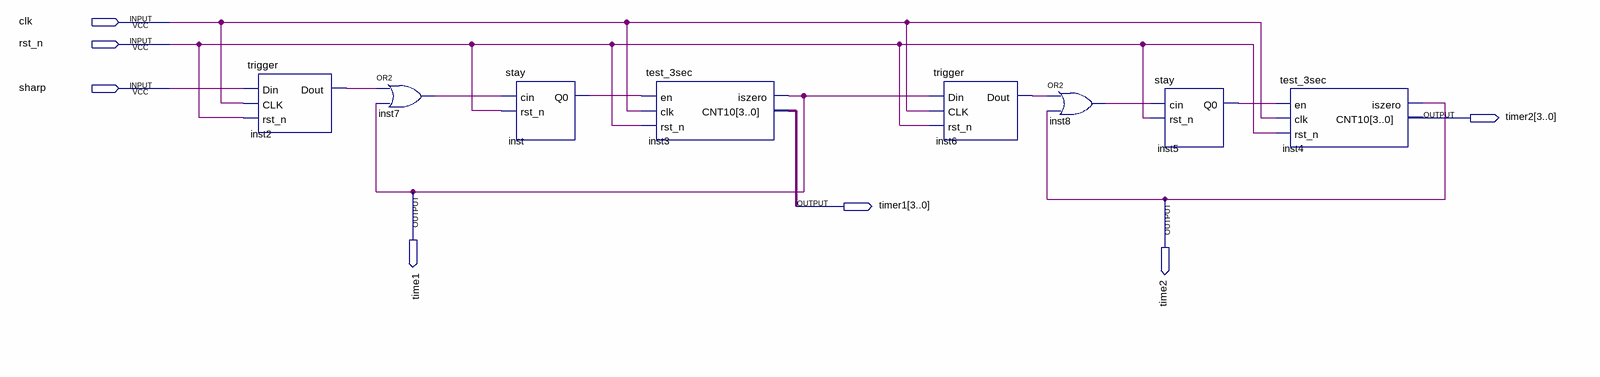
[diagram p0: schematic sheet]
// Quartus schematic test.bdf as structural Verilog: 8 symbols, 7 pins
module test (
  input  clk,
  input  rst_n,
  input  sharp,
  output [3:0] timer2,
  output time1,
  output time2,
  output [3:0] timer1
);

  wire inst2_dout, inst5_q0, inst6_dout, inst7_out, inst8_out, inst_q0;

  trigger inst2 (.Din(sharp), .CLK(clk), .rst_n(rst_n), .Dout(inst2_dout));
  or inst7 (inst7_out, inst2_dout, time1);
  stay inst (.cin(inst7_out), .rst_n(rst_n), .Q0(inst_q0));
  test_3sec inst3 (.en(inst_q0), .clk(clk), .rst_n(rst_n), .iszero(time1), .CNT10(timer1));
  trigger inst6 (.Din(time1), .CLK(clk), .rst_n(rst_n), .Dout(inst6_dout));
  or inst8 (inst8_out, inst6_dout, time2);
  stay inst5 (.cin(inst8_out), .rst_n(rst_n), .Q0(inst5_q0));
  test_3sec inst4 (.en(inst5_q0), .clk(clk), .rst_n(rst_n), .iszero(time2), .CNT10(timer2));
endmodule
